# Altium schematic sheet Audio_Codec.SchDoc: Apalis Evaluation Board 1.1
size A3; Organization: Toradex AG; Address1: Altsagenstrasse 5; Address2: Horw; Address3: 6048; Address4: Switzerland; DocumentNumber: 11; Revision: V1.1; SheetNumber: 11; SheetTotal: 32; PageSetup: Record=PageOptions|CenterHorizontal=True|CenterVertical=True|PrintScale=0.73|XCorrection=1.00|YCorrection=1.00|PrintKind=0|BorderSize=5000000|LeftOffset=0|BottomOffset=0|Orientation=2|PaperLength=1000|PaperWidth=1000|Scale=100|PaperSource=7|PrintQuality=-4|MediaType=1|DitherType=10|PaperKind=A4|PrintScaleMode=1
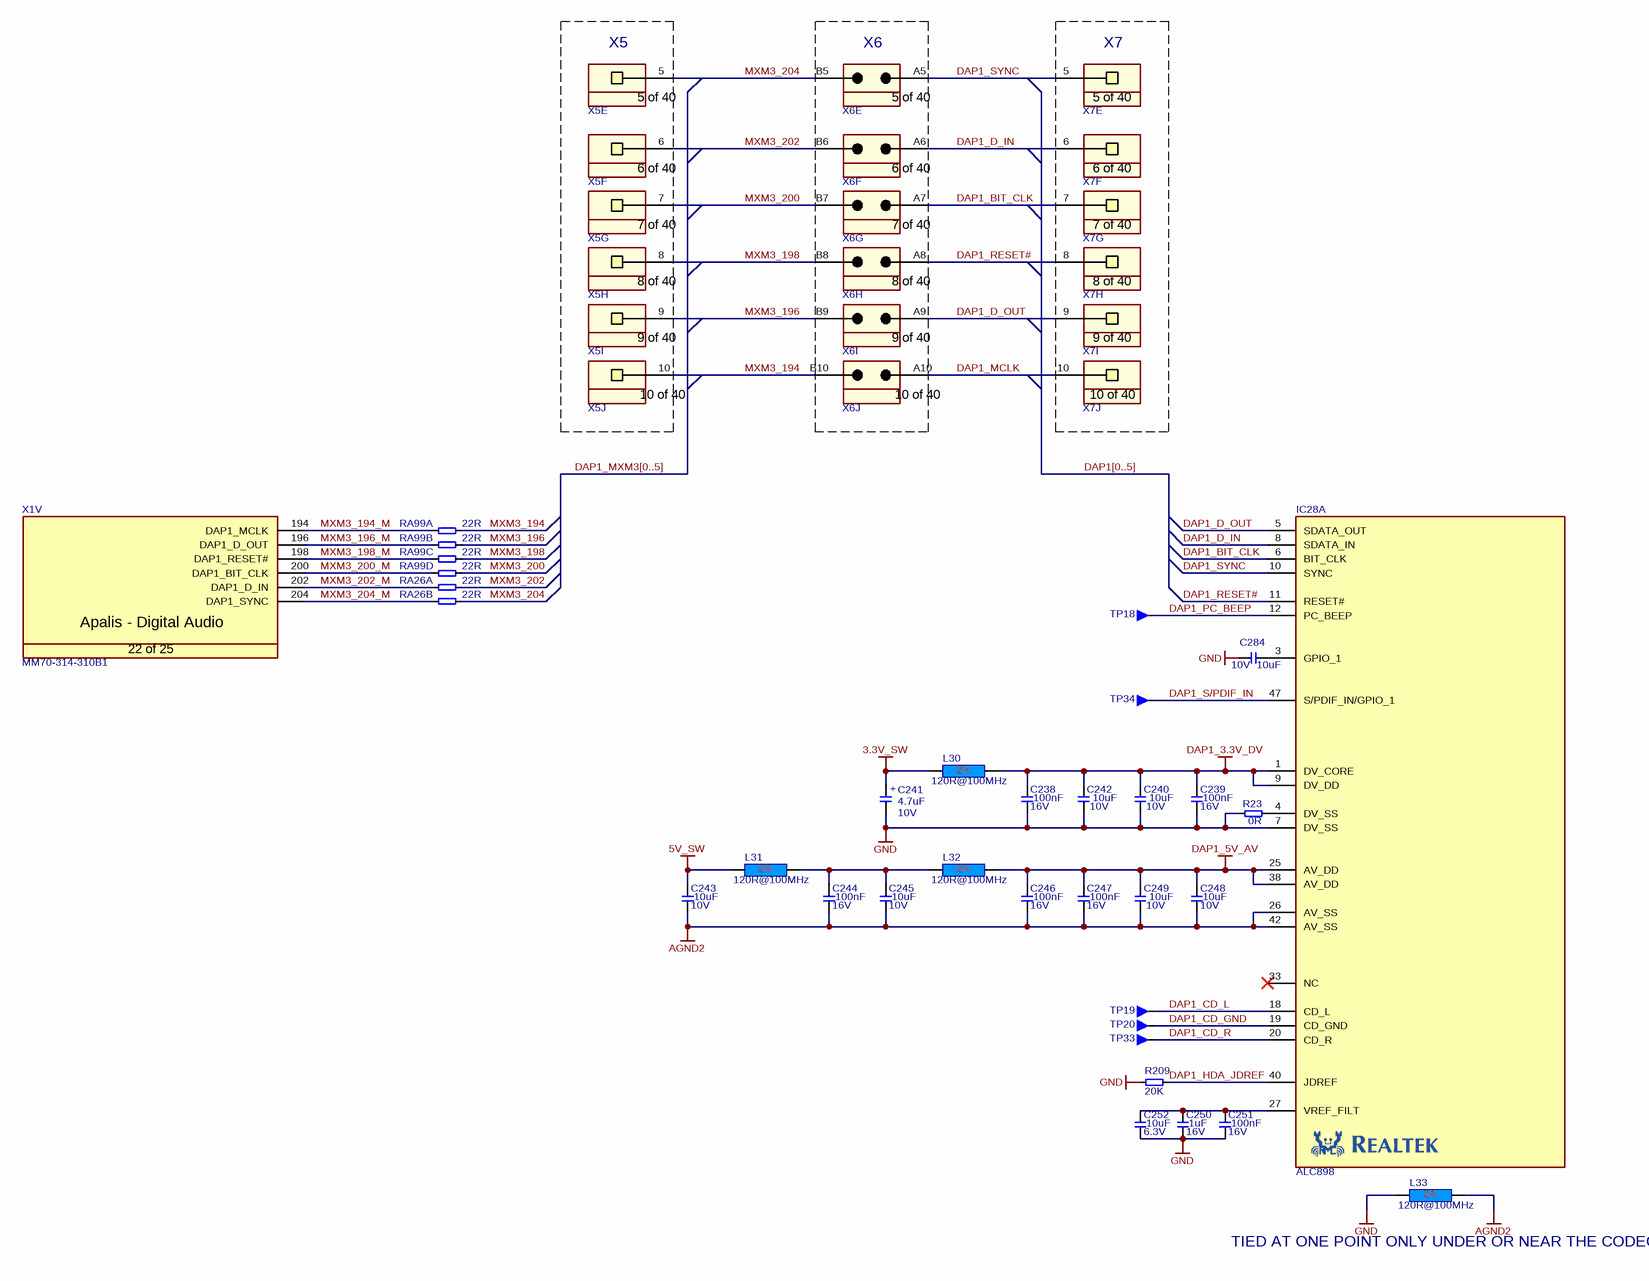
[diagram p0: Audio_Codec.SchDoc]

## Parts
C238  Rating: 16V  [CAPC1005X60N]  (hidden comment: 100nF)
C239  Rating: 16V  [CAPC1005X60N]  (hidden comment: 100nF)
C240  Rating: 10V  [T_CAPC0603X33N]  (hidden comment: 10uF)
C241  Rating: 10V  [T_CAPMP3216X180N]  (hidden comment: 4.7uF)
C242  Rating: 10V  [T_CAPC0603X33N]  (hidden comment: 10uF)
C243  Rating: 10V  [T_CAPC0603X33N]  (hidden comment: 10uF)
C244  Rating: 16V  [CAPC1005X60N]  (hidden comment: 100nF)
C245  Rating: 10V  [T_CAPC0603X33N]  (hidden comment: 10uF)
C246  Rating: 16V  [CAPC1005X60N]  (hidden comment: 100nF)
C247  Rating: 16V  [CAPC1005X60N]  (hidden comment: 100nF)
C248  Rating: 10V  [T_CAPC0603X33N]  (hidden comment: 10uF)
C249  Rating: 10V  [T_CAPC0603X33N]  (hidden comment: 10uF)
C250  Rating: 16V  [CAPC1005X60N]  (hidden comment: 1uF)
C251  Rating: 16V  [CAPC1005X60N]  (hidden comment: 100nF)
C252  Rating: 6.3V  [T_CAPC0603X33N]  (hidden comment: 10uF)
C284  Rating: 10V  [T_CAPC0603X33N]  (hidden comment: 10uF)
IC28  ALC898  [TSQFP50P900X900X160-48N]  (part A of 2)
L30  120R@100MHz  [INDC1608X95N]
L31  120R@100MHz  [INDC1608X95N]
L32  120R@100MHz  [INDC1608X95N]
L33  120R@100MHz  [INDC1608X95N]
R23  0R  [RESC1005X40N]
R209  20K  [T_RESC0603X30N]
RA26  22R  [T_Resistor_Array_X4]  (parts A,B of 4)
RA99  22R  [T_Resistor_Array_X4]  (parts A,B,C,D of 4)
TP18  Testpin  [T_TP-THT]  (value not drawn)
TP19  Testpin  [T_TP-THT]  (value not drawn)
TP20  Testpin  [T_TP-THT]  (value not drawn)
TP33  Testpin  [T_TP-THT]  (value not drawn)
TP34  Testpin  [T_TP-THT]  (value not drawn)
X1  Manufacturer Part No.: MM70-314-310B1  [T_JAE_MM70-314-310B1]  (hidden comment: CON-JAE-MM70-314-310B1-314-0.5mm)  (part V of 25)
X5  SSW-110-01-G-S  [T_Samtec_SSW-110-01-G-S]  (value not drawn)  (parts E,F,G,H,I,J of 40)
X6  TSW-110-07-G-D  [T_Samtec_TSW-110-07-G-D]  (value not drawn)  (parts E,F,G,H,I,J of 40)
X7  SSW-110-01-G-S  [T_Samtec_SSW-110-01-G-S]  (value not drawn)  (parts E,F,G,H,I,J of 40)

## Blocks framed on the sheet
X5: X5
X6: X6
X7: X7

## Nets
3.3V_SW: C241.1 L30.1
5V_SW: C243.2 L31.1
AGND2: C243.1 C244.1 C245.1 C246.1 C247.1 C248.1 C249.1 IC28.26(AV_SS) IC28.42(AV_SS) L33.2
DAP1_3.3V_DV: C238.2 C239.2 C240.2 C242.2 IC28.1(DV_CORE) IC28.9(DV_DD) L30.2
DAP1_5V_AV: C246.2 C247.2 C248.2 C249.2 IC28.25(AV_DD) IC28.38(AV_DD) L32.2
GND: C238.1 C239.1 C240.1 C241.2 C242.1 C250.1 C251.1 C252.1 C284.2 IC28.7(DV_SS) L33.1 R23.1 R209.1
DAP1_BIT_CLK: IC28.6(BIT_CLK) X6.A7 X7.7
DAP1_CD_GND: IC28.19(CD_GND) TP20.1
DAP1_CD_L: IC28.18(CD_L) TP19.1
DAP1_CD_R: IC28.20(CD_R) TP33.1
DAP1_D_IN: IC28.8(SDATA_IN) X6.A6 X7.6
DAP1_D_OUT: IC28.5(SDATA_OUT) X6.A9 X7.9
DAP1_HDA_JDREF: IC28.40(JDREF) R209.2
DAP1_MCLK: X6.A10 X7.10
DAP1_PC_BEEP: IC28.12(PC_BEEP) TP18.1
DAP1_RESET#: IC28.11(RESET#) X6.A8 X7.8
DAP1_S/PDIF_IN: IC28.47(S/PDIF_IN/GPIO_1) TP34.1
DAP1_SYNC: IC28.10(SYNC) X6.A5 X7.5
MXM3_194: RA99.5 X5.10 X6.B10
MXM3_194_M: RA99.1 X1.194(DAP1_MCLK)
MXM3_196: RA99.6 X5.9 X6.B9
MXM3_196_M: RA99.2 X1.196(DAP1_D_OUT)
MXM3_198: RA99.7 X5.8 X6.B8
MXM3_198_M: RA99.3 X1.198(DAP1_RESET#)
MXM3_200: RA99.8 X5.7 X6.B7
MXM3_200_M: RA99.4 X1.200(DAP1_BIT_CLK)
MXM3_202: RA26.5 X5.6 X6.B6
MXM3_202_M: RA26.1 X1.202(DAP1_D_IN)
MXM3_204: RA26.6 X5.5 X6.B5
MXM3_204_M: RA26.2 X1.204(DAP1_SYNC)
NetC244_2: C244.2 C245.2 L31.2 L32.1
NetC250_2: C250.2 C251.2 C252.2 IC28.27(VREF_FILT)
NetC284_1: C284.1 IC28.3(GPIO_1)
NetIC28_4: IC28.4(DV_SS) R23.2

Not connected (* = marked no-connect by the designer): IC28 33(NC)*

## Buses and harness runs
bus DAP1[0..5]
bus DAP1_MXM3[0..5]

## Notes on the sheet
- (near L33) TIED AT ONE POINT ONLY UNDER OR NEAR THE CODEC
- Title
- Size:
- Date:
- A3
- Number:
- Time:
- Revision:
- Sheet
- of
- File:
- (in symbol C-TA-4.7uF-10V-20%-3216) +
- (in symbol CON-JAE-MM70-314-310B1-314-0.5mm, part V) Apalis - Digital Audio; 22 of 25
- (in symbol CON-Samtec-SSW-110-01-G-S, part E) 5 of 40
- (in symbol CON-Samtec-SSW-110-01-G-S, part F) 6 of 40
- (in symbol CON-Samtec-SSW-110-01-G-S, part G) 7 of 40
- (in symbol CON-Samtec-SSW-110-01-G-S, part H) 8 of 40
- (in symbol CON-Samtec-SSW-110-01-G-S, part I) 9 of 40
- (in symbol CON-Samtec-SSW-110-01-G-S, part J) 10 of 40
- (in symbol CON-Samtec-TSW-110-07-G-D, part E) 5 of 40
- (in symbol CON-Samtec-TSW-110-07-G-D, part F) 6 of 40
- (in symbol CON-Samtec-TSW-110-07-G-D, part G) 7 of 40
- (in symbol CON-Samtec-TSW-110-07-G-D, part H) 8 of 40
- (in symbol CON-Samtec-TSW-110-07-G-D, part I) 9 of 40
- (in symbol CON-Samtec-TSW-110-07-G-D, part J) 10 of 40

## Library data of the parts
C238 C239 C244 C246 C247 C251 = C-X7R-100nF-16V-10%-0402: Capacitor Ceramic X7R 100nF 16V 10% 0402; Tolerance: 10%; Type: X7R; Value: 100nF
C240 C242 C243 C245 C248 C249 C284 = C-X5R-10uF-10V-20%-0603: Capacitor Ceramic X5R 10uF 10V 20% 0603; Tolerance: 20%; Type: X5R; Value: 10uF
C241 = C-TA-4.7uF-10V-20%-3216: Capacitor TA 4.7uF 10V 20% 3216; Tolerance: 20%; Type: TA; Value: 4.7uF
C250 = C-X5R-1uF-16V-10%-0402: Capacitor Ceramic X5R 1uF 16V 10% 0402; Tolerance: 10%; Type: X5R; Value: 1uF
C252 = C-X5R-10uF-6.3V-20%-0603: Capacitor Ceramic X5R 10uF 6.3V 20% 0603; Tolerance: 20%; Type: X5R; Value: 10uF
IC28 = IC-Realtek-ALC898: HD_AUDIO_CODEC; Manufacturer Part No.: ALC898; Manufacturer Name: Realtek
L30-L33 = L-120R@100MHz-2A-25%-0603: 120R@100MHz 2A EMI FILTER; Tolerance: 25%; Rating: 2A; Value: 120R@100MHz
R23 = R-0R-63mW-1%-0402: Resistor 0 ohm 63mW 1% 0402; Rating: 63mW; Tolerance: 1%; Value: 0R
R209 = R-20KR-63mW-1%-0603: Resistor 20 Kohm 63mW 1% 0603; Value: 20KR; Rating: 63mW; Tolerance: 1%
RA26 RA99 = RA-22R-63mW-5%-1206-div: Resistor Array 22 R 63mW 5% 1206; Tolerance: 5%; Power Dissipation: 63mW; Value: 22R
TP18-TP20 TP33 TP34 = Testpin: Testpin TH
X1 = CON-JAE-MM70-314-310B1-314-0.5mm: MXM3 Connector; Manufacturer Name: JAE; No. of ways: 314
X5 X7 = CON-Samtec-SSW-110-01-G-S: Receptacle Female Socket 1x40 pin 2.54mm pitch; Manufacturer Name: Samtec; Pitch: 2.54mm; No. of ways: 1x40; Manufacturer Part No.: SSW-110-01-G-S
X6 = CON-Samtec-TSW-110-07-G-D: Header 2x40 pin 2.54mm pitch; Manufacturer Name: Samtec; Pitch: 2.54mm; No. of ways: 2x40; Manufacturer Part No.: TSW-110-07-G-D